# EAGLE design sawbench_analog_reva (EAGLE 6.5.0)
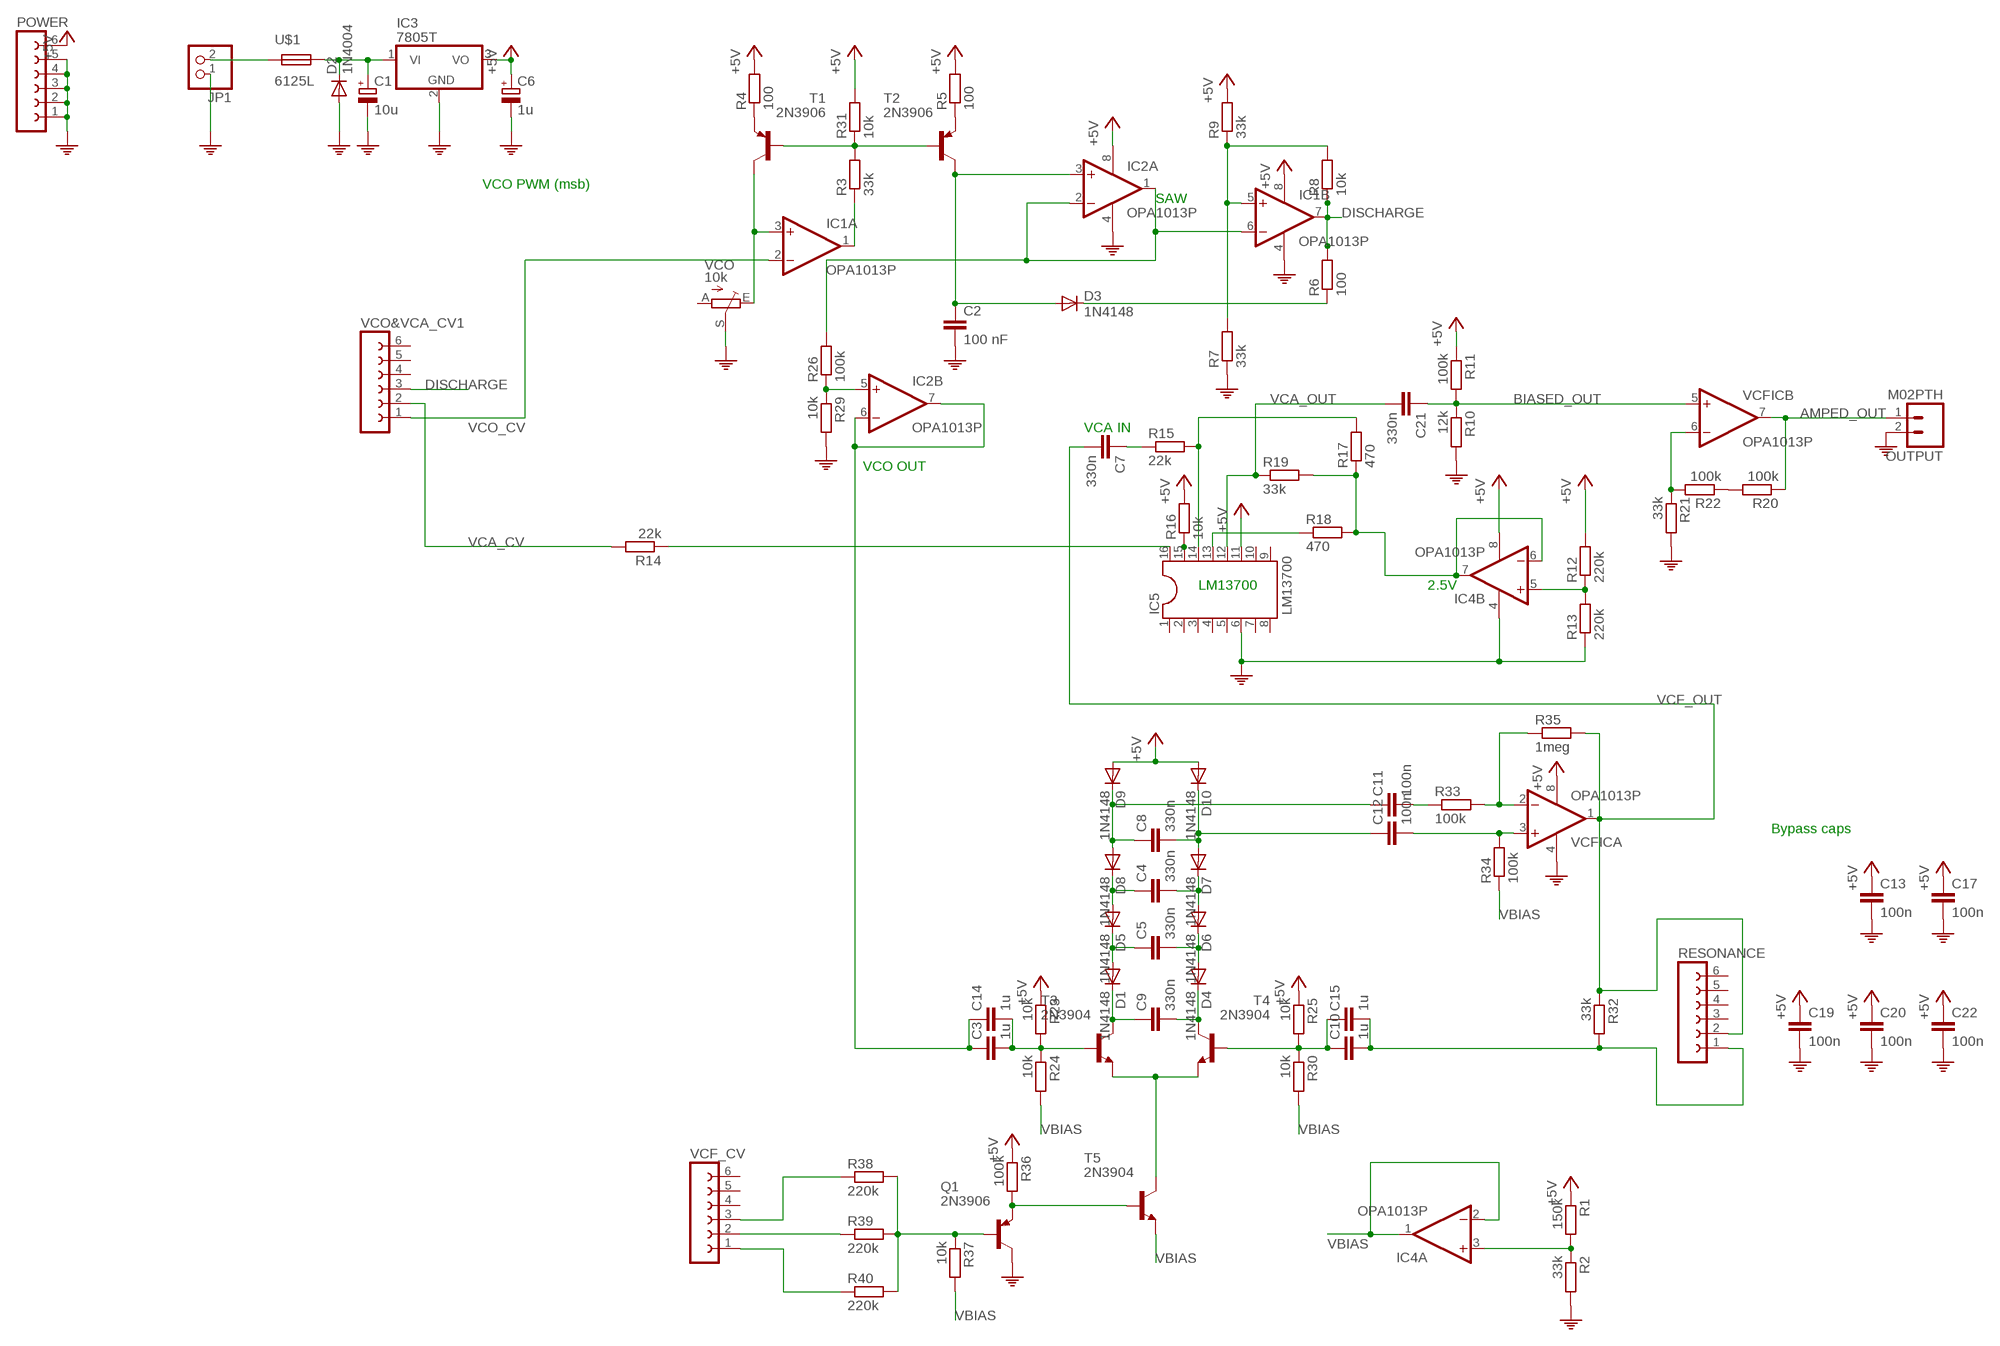
[diagram p0: schematic, sheet 1]

## Parts
C1  10u  CPOL-EUE2.5-6  [E2,5-6]
C2  100 nF  C-EU050-030X075  [C050-030X075]
C3  1u  C-EU050-024X044  [C050-024X044]
C4  330n  C-EU050-030X075  [C050-030X075]
C5  330n  C-EU050-030X075  [C050-030X075]
C6  1u  CPOL-EUE2.5-6  [E2,5-6]
C7  330n  C-EU050-024X044  [C050-024X044]
C8  330n  C-EU050-030X075  [C050-030X075]
C9  330n  C-EU050-030X075  [C050-030X075]
C10  1u  C-EU050-024X044  [C050-024X044]
C11  100n  C-EU050-025X075  [C050-025X075]
C12  100n  C-EU050-025X075  [C050-025X075]
C13  100n  C-EU025-024X044  [C025-024X044]
C14  1u  C-EU050-024X044  [C050-024X044]
C15  1u  C-EU050-024X044  [C050-024X044]
C17  100n  C-EU025-024X044  [C025-024X044]
C19  100n  C-EU025-024X044  [C025-024X044]
C20  100n  C-EU025-024X044  [C025-024X044]
C21  330n  C-EU050-024X044  [C050-024X044]
C22  100n  C-EU025-024X044  [C025-024X044]
D1  1N4148  DIODE-D-5  [D-5]
D2  1N4004  [DO41-10]
D3  1N4148  DIODE-D-5  [D-5]
D4  1N4148  DIODE-D-5  [D-5]
D5  1N4148  DIODE-D-5  [D-5]
D6  1N4148  DIODE-D-5  [D-5]
D7  1N4148  DIODE-D-5  [D-5]
D8  1N4148  DIODE-D-5  [D-5]
D9  1N4148  DIODE-D-5  [D-5]
D10  1N4148  DIODE-D-5  [D-5]
IC1  OPA1013P  [DIL08]
IC2  OPA1013P  [DIL08]
IC3  7805T  [TO220H]
IC4  OPA1013P  [DIL08]
IC5  LM13700  DIL16  [DIL16]
JP1  PINHD-1X2  [1X02]
OUTPUT  M02PTH  [1X02]
POWER  FE06-1  [FE06]
Q1  2N3906  2N3906-PNP-TO92-EBC  [TO92-EBC]
R1  150k  R-EU_0204/7  [0204/7]
R2  33k  R-EU_0204/7  [0204/7]
R3  33k  R-EU_0204/7  [0204/7]
R4  100  R-EU_0204/7  [0204/7]
R5  100  R-EU_0204/7  [0204/7]
R6  100  R-EU_0204/7  [0204/7]
R7  33k  R-EU_0204/7  [0204/7]
R8  10k  R-EU_0204/7  [0204/7]
R9  33k  R-EU_0204/7  [0204/7]
R10  12k  R-EU_0204/7  [0204/7]
R11  100k  R-EU_0204/7  [0204/7]
R12  220k  R-EU_0204/7  [0204/7]
R13  220k  R-EU_0204/7  [0204/7]
R14  22k  R-EU_0204/7  [0204/7]
R15  22k  R-EU_0204/7  [0204/7]
R16  10k  R-EU_0204/7  [0204/7]
R17  470  R-EU_0204/7  [0204/7]
R18  470  R-EU_0204/7  [0204/7]
R19  33k  R-EU_0204/7  [0204/7]
R20  100k  R-EU_0204/7  [0204/7]
R21  33k  R-EU_0204/7  [0204/7]
R22  100k  R-EU_0204/7  [0204/7]
R23  10k  R-EU_0204/7  [0204/7]
R24  10k  R-EU_0204/7  [0204/7]
R25  10k  R-EU_0204/7  [0204/7]
R26  100k  R-EU_0204/7  [0204/7]
R29  10k  R-EU_0204/7  [0204/7]
R30  10k  R-EU_0204/7  [0204/7]
R31  10k  R-EU_0204/7  [0204/7]
R32  33k  R-EU_0204/7  [0204/7]
R33  100k  R-EU_0204/7  [0204/7]
R34  100k  R-EU_0204/7  [0204/7]
R35  1meg  R-EU_0204/7  [0204/7]
R36  100k  R-EU_0204/7  [0204/7]
R37  10k  R-EU_0204/7  [0204/7]
R38  220k  R-EU_0204/7  [0204/7]
R39  220k  R-EU_0204/7  [0204/7]
R40  220k  R-EU_0204/7  [0204/7]
RESONANCE  FE06-1  [FE06]
T1  2N3906  2N3906-PNP-TO92-EBC  [TO92-EBC]
T2  2N3906  2N3906-PNP-TO92-EBC  [TO92-EBC]
T3  2N3904  2N3904-NPN-TO92-EBC  [TO92-EBC]
T4  2N3904  2N3904-NPN-TO92-EBC  [TO92-EBC]
T5  2N3904  2N3904-NPN-TO92-EBC  [TO92-EBC]
U$1  6125L  [6125L]
VCF_CV  FE06-1  [FE06]
VCFIC  OPA1013P  [DIL08]
VCO  10k  TRIM_EU-RJ9W  [RJ9W]
VCO&VCA_CV1  FE06-1  [FE06]

## Nets
+5V: C6.+ C13.1 C17.1 C19.1 C20.1 C22.1 D9.A D10.A IC1.8(P:V+) IC2.8(P:V+) IC3.3(VO) IC4.8(P:V+) IC5.11 POWER.6 R1.1 R4.2 R5.2 R9.2 R11.1 R12.2 R16.2 R23.1 R25.1 R31.2 R36.1 VCFIC.8(P:V+)
AMPED_OUT: OUTPUT.1 R20.1 VCFIC.7(B:OUT)
BIASED_OUT: C21.1 R10.1 R11.2 VCFIC.5(B:+IN)
DISCHARGE: IC1.7(B:OUT) R6.2 R8.1 VCO&VCA_CV1.3
N$1: R20.2 R22.1
N$2: IC1.3(A:+IN) T1.C VCO.E
N$3: C3.1 C14.1 IC2.6(B:-IN) IC2.7(B:OUT)
N$4: C2.1 D3.A IC2.3(A:+IN) T2.C
N$5: IC1.1(A:OUT) R3.1
N$6: R3.2 R31.1 T1.B T2.B
N$7: R4.1 T1.E
N$8: R5.1 T2.E
N$9: IC5.16 R14.1
N$10: IC1.6(B:-IN) IC2.1(A:OUT) IC2.2(A:-IN) R26.2
N$11: R40.1 VCF_CV.1
N$12: R39.1 VCF_CV.2
N$13: IC1.5(B:+IN) R7.2 R8.2 R9.1
N$14: JP1.2 U$1.P$1
N$15: D3.C R6.1
N$16: R38.1 VCF_CV.3
N$18: IC4.3(A:+IN) R1.2 R2.1
N$19: IC4.5(B:+IN) R12.1 R13.2
N$20: IC5.13 R18.1
N$21: IC5.14 R15.2 R17.2
N$22: IC5.15 R16.1
N$24: R21.1 R22.2 VCFIC.6(B:-IN)
N$26: IC4.6(B:-IN) IC4.7(B:OUT) R17.1 R18.2 R19.2
N$27: C3.2 C14.2 R23.2 R24.1 T3.B
N$28: T3.E T4.E T5.C
N$29: C9.1 D1.C T3.C
N$31: C9.2 D4.C T4.C
N$33: C5.1 D1.A D5.C
N$35: C1.+ D2.C IC3.1(VI) U$1.P$2
N$37: IC2.5(B:+IN) R26.1 R29.1
N$38: C7.1 R15.1
N$39: C4.1 D5.A D8.C
N$40: C8.1 C11.1 D8.A D9.C
N$41: C8.2 C12.1 D7.A D10.C
N$42: C4.2 D6.A D7.C
N$43: C5.2 D4.A D6.C
N$45: C10.1 C15.1 R25.2 R30.1 T4.B
N$46: C10.2 C15.2 R32.2 RESONANCE.1
N$48: C11.2 R33.1
N$49: C12.2 R34.2 VCFIC.3(A:+IN)
N$50: R33.2 R35.1 VCFIC.2(A:-IN)
N$51: Q1.E R36.2 T5.B
N$52: Q1.B R37.1 R38.2 R39.2 R40.2
PE: C1.- C2.2 C6.- C13.2 C17.2 C19.2 C20.2 C22.2 D2.A IC1.4(P:V-) IC2.4(P:V-) IC3.2(GND) IC4.4(P:V-) IC5.6 JP1.1 OUTPUT.2 POWER.1 POWER.2 POWER.3 POWER.4 POWER.5 Q1.C R2.2 R7.1 R10.2 R13.1 R21.2 R29.2 VCFIC.4(P:V-) VCO.S
VBIAS: IC4.1(A:OUT) IC4.2(A:-IN) R24.2 R30.2 R34.1 R37.2 T5.E
VCA_CV: R14.2 VCO&VCA_CV1.2
VCA_OUT: C21.2 IC5.12 R19.1
VCF_OUT: C7.2 R32.1 R35.2 RESONANCE.2 VCFIC.1(A:OUT)
VCO_CV: IC1.2(A:-IN) VCO&VCA_CV1.1
Unconnected: IC5.1 IC5.2 IC5.3 IC5.4 IC5.5 IC5.7 IC5.8 IC5.9 IC5.10 RESONANCE.3 RESONANCE.4 RESONANCE.5 RESONANCE.6 VCF_CV.4 VCF_CV.5 VCF_CV.6 VCO&VCA_CV1.4 VCO&VCA_CV1.5 VCO&VCA_CV1.6 VCO.A

## Notes on the sheet
- VCO PWM (msb)
- SAW
- VCA IN
- VCO OUT
- LM13700 | 2.5V
- Bypass caps

## Library data of the parts
C1 C6 = resistor:CPOL-EU: POLARIZED CAPACITOR, European symbol
C2 = resistor:C-EU: CAPACITOR, European symbol; CAPACITANCE: 100 nF
C3 C7 C10-C15 C17 C19-C22 = resistor:C-EU: CAPACITOR, European symbol
C4 C5 C8 C9 = rcl:C-EU: CAPACITOR, European symbol
D1 D3-D10 = diode:DIODE-: DIODE
D2 = diode:1N4004: DIODE general purpose rectifier, 1 A
IC1 IC2 IC4 VCFIC = linear:OPA1013: OP AMP
IC3 = linear:78*: Positive VOLTAGE REGULATOR Source: http://cache.national.com/ds/LM/LM78L05.pdf http://www.fairchildsemi.com/ds/LM/LM7805.pdf
IC5 = ic-package:DIL16: Dual In Line / Socket
JP1 = pinhead:PINHD-1X2: PIN HEADER
OUTPUT = SparkFun-Connectors:M02: Standard 2-pin 0.1" header. Use with - straight break away headers ( PRT-00116) - right angle break away headers (PRT-00553) - swiss pins (PRT-00743) - machine pins (PRT-00117) - female headers (PRT-00115) Molex polarized connector foot print use with: PRT-08233 with associated crimp pins and housings. 2.54_SCREWTERM for use with PRT-10571. 3.5mm Screw Terminal footprints for PRT-08084 5mm Screw Terminal footprints for use with PRT-08432
POWER RESONANCE VCF_CV VCO&VCA_CV1 = con-lsta:FE06-1: FEMALE HEADER; OC_FARNELL: unknown; OC_NEWARK: unknown
Q1 T1 T2 = transistor-neu-to92:*-PNP-: PNP Transistror
R1-R3 R6-R26 R29-R40 = resistor:R-EU_: RESISTOR, European symbol
R4 = resistor:R-EU_: RESISTOR, European symbol; R: 100 ohm
R5 = resistor:R-EU_: RESISTOR, European symbol; RESISTANCE: 100 ohm
T3-T5 = transistor-neu-to92:*-NPN-: NPN Transistror
U$1 = littlefuse:6125L
VCO = pot:TRIM_EU-: POTENTIOMETER

## Net classes
0 default: width 0.203 mm

## Board
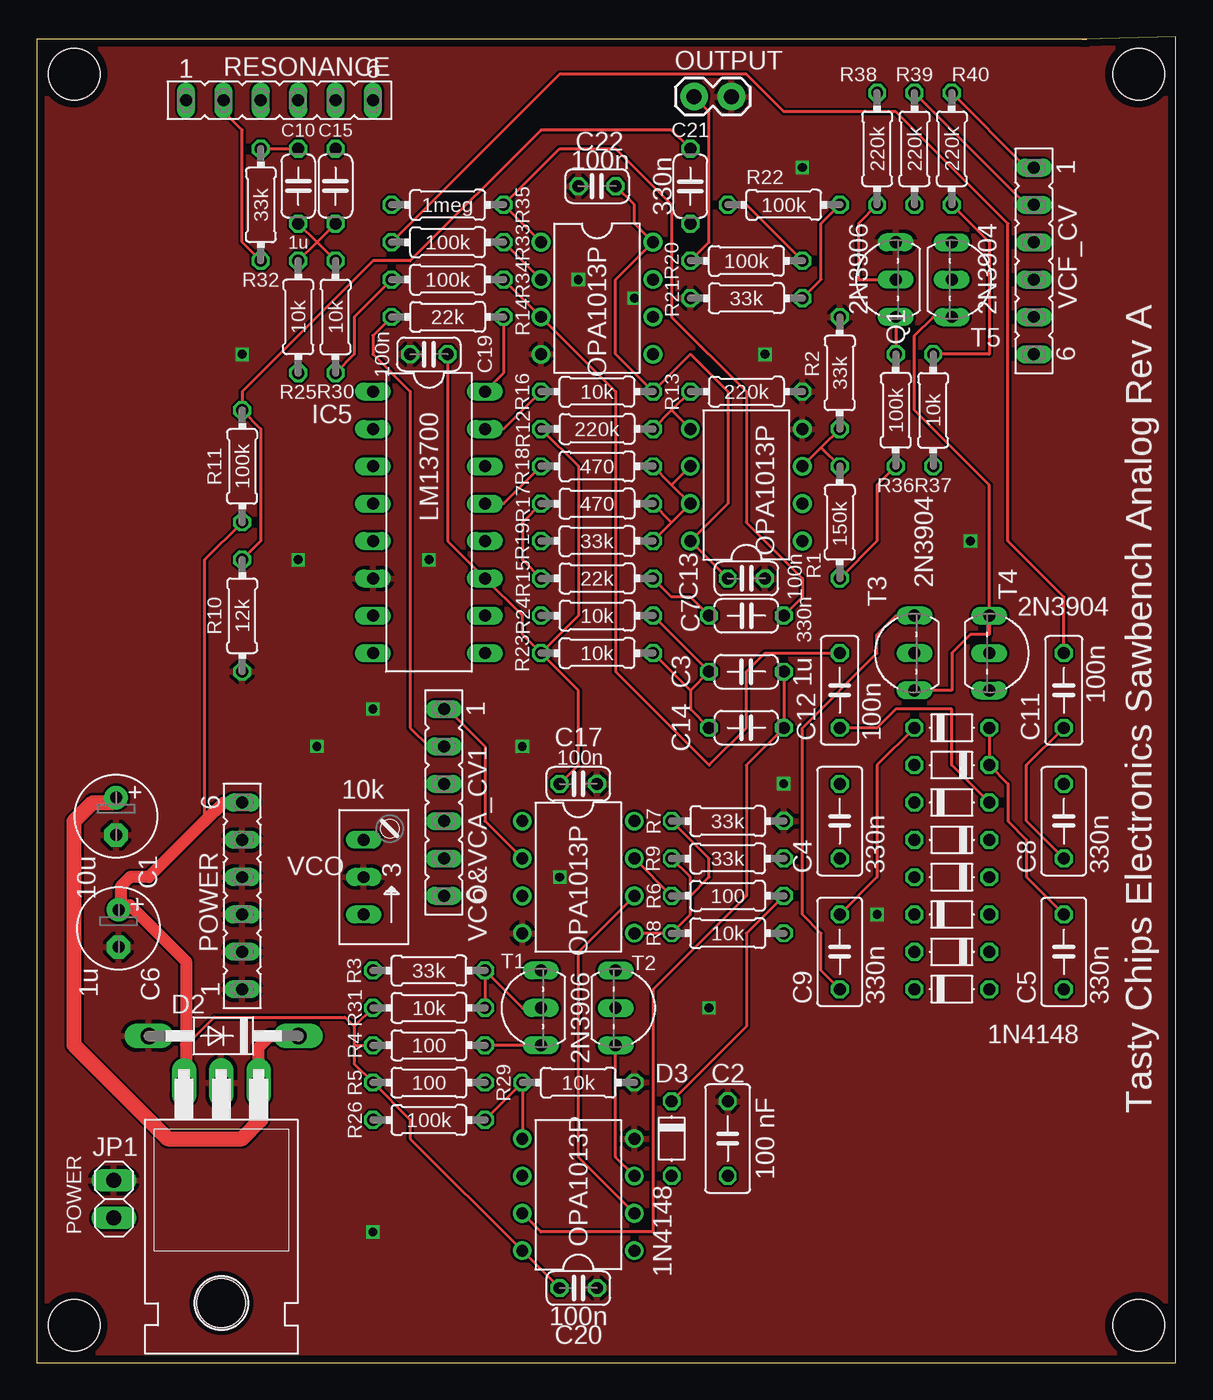
[diagram p1: board, top side]
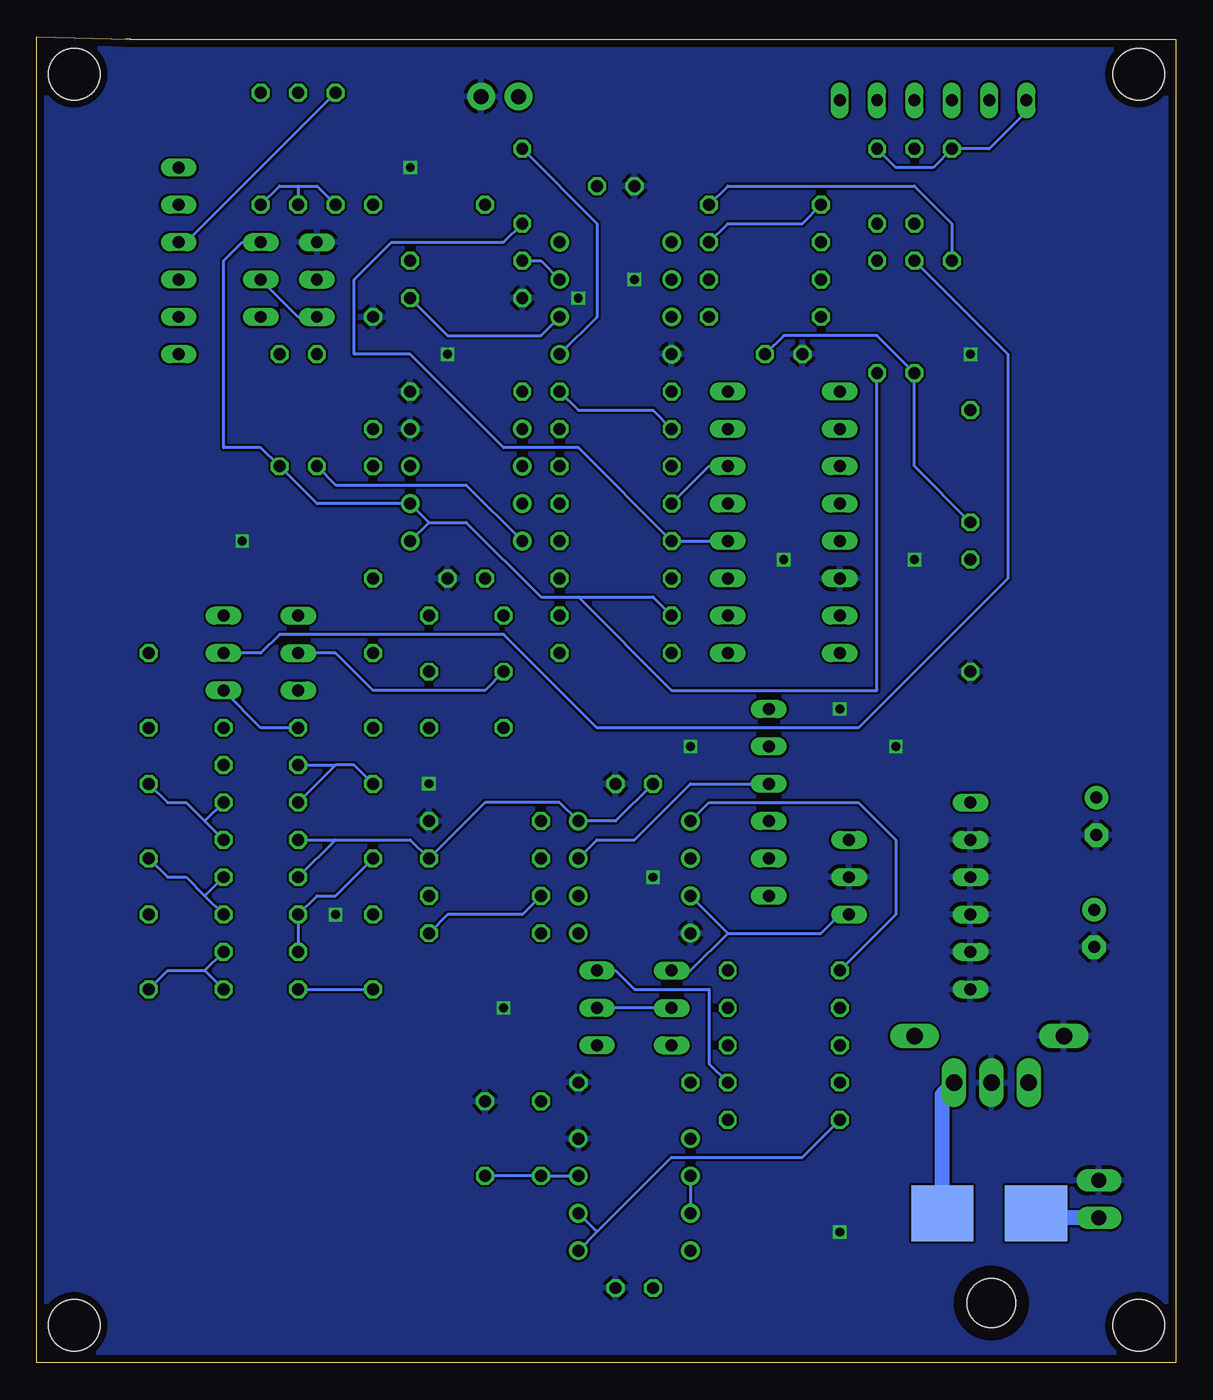
[diagram p2: board, bottom side, seen from below]

Size 77.47 x 90.17 mm. Coordinates in mm from the lower left corner, seen from the top.
Outline: 71.12,90 77.47,90.17 77.47,0 0,0 0,90 71.12,90
Outline: 71.12,90 71.42,90
Copper layers (1*16): Top 0.035mm / dielectric 1.6mm / Bottom 0.035mm
Design rules "Elecrow_2-layer_PCB_eagle_rule": minimum track width 6mil, minimum drill 12mil, track to track 6mil, track to pad 8mil, pad to pad 12mil, via to via 12mil, smd to smd 0mil, copper to edge 20mil, drill to drill 10mil, minimum pad ring 6mil, minimum via ring 6mil, stop-mask expansion 0mil, vias tented up to drill 100mil, thermal gap 10mil
Holes 3.5 mm at 2.54,87.63 2.54,2.54 74.93,2.54 74.93,87.63

### Footprints (pad centres in the part's own frame; a part is rotated, then mirrored left to right if it is on the bottom)
E2,5-6 = drill 0.813 pad 1.6: + -1.27,0 | drill 0.813 pad 1.6 octagon: - 1.27,0
C050-030X075 = drill 0.813 octagon: 1 -2.54,0; 2 2.54,0
C050-024X044 = drill 0.813 octagon: 1 -2.54,0; 2 2.54,0
C050-025X075 = drill 0.813 octagon: 1 -2.54,0; 2 2.54,0
C025-024X044 = drill 0.813 octagon: 1 -1.27,0; 2 1.27,0
D-5 = drill 0.813 octagon: A 2.54,0; C -2.54,0
DO41-10 = drill 1.118 long: A 5.08,0; C -5.08,0
DIL08 = drill 0.813 pad 1.27: 1 -3.81,-3.81; 2 -1.27,-3.81; 3 1.27,-3.81; 4 3.81,-3.81; 5 3.81,3.81; 6 1.27,3.81; 7 -1.27,3.81; 8 -3.81,3.81
TO220H = drill 1.118 long: 1 -2.54,-10.16; 2 0,-10.16; 3 2.54,-10.16 | hole 3.302: 0,4.826
DIL16 = drill 0.813 long: 1 -8.89,-3.81; 2 -6.35,-3.81; 3 -3.81,-3.81; 4 -1.27,-3.81; 5 1.27,-3.81; 6 3.81,-3.81; 7 6.35,-3.81; 8 8.89,-3.81; 9 8.89,3.81; 10 6.35,3.81; 11 3.81,3.81; 12 1.27,3.81; 13 -1.27,3.81; 14 -3.81,3.81; 15 -6.35,3.81; 16 -8.89,3.81
1X02 = drill 1.016 long: 1 -1.27,0; 2 1.27,0
1X02' = drill 1.016 pad 1.88: 1 0,0; 2 2.54,0
FE06 = drill 0.813 long: 1 -6.35,0; 2 -3.81,0; 3 -1.27,0; 4 1.27,0; 5 3.81,0; 6 6.35,0
TO92-EBC = drill 0.813 long: B 0,-1.27; C 2.54,-1.27; E -2.54,-1.27
0204/7 = drill 0.813 octagon: 1 -3.81,0; 2 3.81,0
6125L = smd 4.24 x 3.81: P$1 3.185,0; P$2 -3.185,0
RJ9W = drill 0.813 long: A 2.54,0.635; E -2.54,0.635; S 0,0.635

### Placement (x,y rotation side)
C1  5.4,37.16 270 top
C2  46.99,15.24 90 top
C3  48.26,46.99 180 top
C4  54.61,36.83 90 top
C5  69.85,27.94 90 top
C6  5.56,29.54 270 top
C7  48.26,50.8 0 top
C8  69.85,36.83 90 top
C9  54.61,27.94 90 top
C10  17.78,80.01 90 top
C11  69.85,45.72 90 top
C12  54.61,45.72 90 top
C13  48.26,53.34 0 top
C14  48.26,43.18 180 top
C15  20.32,80.01 90 top
C17  36.83,39.37 0 top
C19  26.67,68.58 180 top
C20  36.83,5.08 0 top
C21  44.45,80.01 270 top
C22  38.1,80.01 180 top
D1  62.23,25.4 0 top
D2  12.7,22.23 180 top
D3  43.18,15.24 270 top
D4  62.23,43.18 0 top
D5  62.23,27.94 180 top
D6  62.23,40.64 180 top
D7  62.23,38.1 0 top
D8  62.23,30.48 0 top
D9  62.23,33.02 180 top
D10  62.23,35.56 180 top
IC1  36.83,33.02 270 top
IC2  36.83,11.43 90 top
IC3  12.55,8.88 180 top
IC4  48.26,59.69 90 top
IC5  26.67,57.15 270 top
JP1  5.24,11.12 270 top
OUTPUT  M02PTH  [1X02']  44.7,86.11 0 top
POWER  13.97,31.75 90 top
Q1  57.15,73.66 90 top
R1  54.61,57.15 90 top
R2  54.61,67.31 90 top
R3  26.67,26.67 0 top
R4  26.67,21.59 180 top
R5  26.67,19.05 180 top
R6  46.99,31.75 180 top
R7  46.99,36.83 180 top
R8  46.99,29.21 180 top
R9  46.99,34.29 0 top
R10  13.97,50.8 270 top
R11  13.97,60.96 90 top
R12  38.1,63.5 180 top
R13  48.26,66.04 180 top
R14  27.94,71.12 180 top
R15  38.1,53.34 180 top
R16  38.1,66.04 0 top
R17  38.1,58.42 180 top
R18  38.1,60.96 0 top
R19  38.1,55.88 0 top
R20  48.26,74.93 0 top
R21  48.26,72.39 180 top
R22  50.8,78.74 0 top
R23  38.1,48.26 0 top
R24  38.1,50.8 180 top
R25  17.78,71.12 90 top
R26  26.67,16.51 180 top
R29  36.83,19.05 0 top
R30  20.32,71.12 270 top
R31  26.67,24.13 180 top
R32  15.24,78.74 90 top
R33  27.94,76.2 0 top
R34  27.94,73.66 0 top
R35  27.94,78.74 0 top
R36  58.42,64.77 90 top
R37  60.96,64.77 270 top
R38  57.15,82.55 270 top
R39  59.69,82.55 270 top
R40  62.23,82.55 270 top
RESONANCE  16.51,85.85 0 top
T1  33.02,24.13 90 top
T2  40.64,24.13 270 top
T3  58.42,48.26 90 top
T4  66.04,48.26 270 top
T5  63.5,73.66 270 top
U$1  12.7,10.16 0 bottom
VCF_CV  67.82,74.93 270 top
VCFIC  38.1,72.39 270 top
VCO  22.86,33.02 90 top
VCO&VCA_CV1  27.69,38.1 270 top

### Tracks (layer width: path | path; a pad name or v marks a point on that pad's centre or on a via)
+5V
  Top 0.203: R23.1 36.83,45.72 36.83,40.64 C17.1 | R23.1 33.02,49.53 33.02,50.8 IC5.11 27.94,55.88 C19.1 | C13.1 IC4.8 46.99,58.42 46.99,66.04 44.45,68.58 R16.2 39.37,68.58 39.37,73.66 VCFIC.8 40.64,77.47 40.64,78.74 C22.1 | R1.1 57.15,55.88 57.15,59.69 R36.1 | R23.1 36.83,50.8 36.83,60.96 R12.2 | C20.1 IC2.8 25.4,15.24 25.4,16.51 R5.2 21.59,20.32 21.59,21.59 | 21.59,22.86 21.59,21.59 | R31.2 21.59,22.86 | 21.59,21.59 R4.2 | R11.1 11.43,54.61 11.43,36.83 | 10.16,21.59 12.06,23.5 20.95,23.5 21.59,22.86
  Top 0.813: POWER.6 12.7,38.1 11.43,36.83 7.62,33.02 6.35,33.02 5.71,32.38 5.71,30.65 | 10.16,19.05 IC3.3 10.16,19.2 10.16,21.59 10.16,27.3 6.35,31.11 5.87,31.11 C6.+ 5.71,30.65 | 5.71,30.48 5.71,30.65
  Bottom 0.203: D10.A 57.15,35.56 | 57.15,35.56 52.07,35.56 R9.2 46.99,38.1 41.91,38.1 IC1.8 38.1,36.83 C17.1 | 57.15,35.56 D9.A | IC4.8 48.26,59.69 57.15,59.69 R36.1 | R12.2 35.56,64.77 40.64,64.77 R16.2 | R11.1 17.78,60.96 R25.1 20.32,69.85 26.67,69.85 C19.1
AMPED_OUT
  Top 0.203: R20.1 45.72,76.2 45.72,85.09 OUTPUT.1 44.45,86.36
  Bottom 0.203: VCFIC.7 43.18,74.93 R20.1
BIASED_OUT
  Top 0.203: R10.1 15.24,55.88 15.24,63.5 R11.2 13.97,66.04 22.86,74.93 25.4,74.93 34.29,83.82 43.18,83.82 C21.1
  Bottom 0.203: VCFIC.5 39.37,71.12 39.37,77.47 C21.1
DISCHARGE
  Top 0.203: IC1.7 R6.2
  Bottom 0.203: VCO&VCA_CV1.3 33.02,39.37 36.83,35.56 39.37,35.56 IC1.7 | R8.1 49.53,30.48 44.45,30.48 R6.2
N$1
  Top 0.203: R20.2 48.26,78.74 R22.1
N$2
  Bottom 0.203: 30.48,29.21 24.13,29.21 22.86,30.48 VCO.E | IC1.3 30.48,29.21 | T1.C 33.02,26.67 30.48,29.21
N$3
  Top 0.203: C3.1 C14.1 48.26,40.64 48.26,31.75 41.91,25.4 41.91,8.89 34.29,8.89 IC2.7
  Bottom 0.203: IC2.6 IC2.7
N$4
  Top 0.203: T2.C 39.37,13.97 IC2.3
  Bottom 0.203: IC2.3 D3.A C2.1
N$5
  Bottom 0.203: R3.1 19.05,30.48 19.05,35.56 21.59,38.1 31.75,38.1 IC1.1
N$6
  Top 0.203: R31.1 R3.2 33.02,24.13 T1.B
  Bottom 0.203: T1.B T2.B
N$7
  Top 0.203: T1.E R4.1
N$8
  Bottom 0.203: R5.1 31.75,20.32 31.75,25.4 36.83,25.4 38.1,26.67 T2.E
N$9
  Top 0.203: IC5.16 31.75,67.31 R14.1
N$10
  Top 0.203: IC1.6 36.83,27.94 36.83,13.97 IC2.2
  Bottom 0.203: 39.37,8.89 IC2.1 | IC2.2 39.37,8.89 | R26.2 25.4,13.97 34.29,13.97 39.37,8.89
N$11
  Top 0.203: R40.1 67.31,81.28 VCF_CV.1
N$12
  Top 0.203: R39.1 67.31,78.74 VCF_CV.2
N$13
  Top 0.203: IC1.5 R8.2 44.45,30.48 44.45,31.75 | R9.1 44.45,33.02 44.45,31.75 | R7.2 45.72,34.29 45.72,33.02 44.45,31.75
N$14
  Bottom 1.016: JP1.2 9.2,9.85 U$1.P$1
N$15
  Top 0.203: D3.C 48.26,22.86 48.26,29.21 R6.1
N$16
  Bottom 0.203: R38.1 67.31,76.2 VCF_CV.3
N$18
  Top 0.203: R2.1 53.34,62.23 | 53.34,62.23 IC4.3 | 53.34,62.23 R1.2
N$19
  Top 0.203: R13.2 43.18,64.77 | 43.18,64.77 R12.1 | 43.18,64.77 IC4.5
N$20
  Top 0.203: IC5.13 31.75,58.42 R18.1
N$21
  Top 0.203: R15.2 33.02,54.61 33.02,57.15 R17.2
  Bottom 0.203: IC5.14 31.75,60.96 R17.2
N$22
  Top 0.203: IC5.15 31.75,63.5 R16.1
N$24
  Top 0.203: R22.2 53.34,77.47 53.34,73.66 R21.1
  Bottom 0.203: VCFIC.6 43.18,69.85 49.53,69.85 R21.1
N$26
  Top 0.203: 43.18,57.15 IC4.7 43.18,59.69 | 43.18,57.15 R19.2 | 43.18,57.15 R17.1 | 43.18,59.69 R18.2 | 43.18,59.69 IC4.6
N$27
  Top 0.203: C14.2 44.45,44.45 44.45,45.72 | 44.45,45.72 C3.2 R24.1 | 44.45,45.72 R23.2
  Bottom 0.203: T3.B 57.15,48.26 54.61,45.72 46.99,45.72 C3.2
N$28
  Top 0.203: T3.E 62.23,45.72 62.23,48.26 63.5,49.53 64.77,49.53 T4.E 64.77,59.69 59.69,64.77 59.69,69.85 60.96,71.12 T5.C
N$29
  Top 0.203: T3.C 58.42,50.8 57.15,49.53 57.15,48.26 52.07,43.18 52.07,30.48 53.34,29.21 53.34,26.67 C9.1
  Bottom 0.203: D1.C C9.1
N$31
  Top 0.203: C9.2 57.15,33.02 57.15,40.64 D4.C
  Bottom 0.203: T4.C 62.23,43.18 D4.C
N$33
  Bottom 0.203: 66.04,26.67 D1.A | 66.04,26.67 68.58,26.67 C5.1 | 66.04,26.67 D5.C
N$35
  Top 0.813: 15.24,17.78 IC3.1 15.09,21.44 15.87,22.23 D2.C
  Top 1.016: IC3.1 15.24,16.51 13.97,15.24 8.89,15.24 2.54,21.59 2.54,36.83 3.81,38.1 5.07,38.1 C1.+
  Bottom 1.016: U$1.P$2 15.88,18.25 IC3.1
N$37
  Top 0.203: R26.1 R29.1 IC2.5
N$38
  Top 0.203: R15.1 43.18,52.07 44.45,52.07 C7.1
N$39
  Bottom 0.203: D5.A D8.C 58.42,31.75 57.15,31.75 C4.1
N$40
  Top 0.203: C11.1 67.31,40.64 67.31,36.83 C8.1
  Bottom 0.203: 66.04,31.75 67.31,33.02 68.58,33.02 C8.1 | 66.04,31.75 D8.A | 66.04,31.75 D9.C
N$41
  Top 0.203: C12.1 57.15,43.18 58.42,44.45 62.23,44.45 62.23,40.64 D7.A
  Bottom 0.203: 66.04,36.83 67.31,38.1 68.58,38.1 C8.2 | 66.04,36.83 D10.C | D7.A 66.04,36.83
N$42
  Bottom 0.203: C4.2 55.88,40.64 57.15,40.64 | D6.A 57.15,40.64 | 57.15,40.64 D7.C
N$43
  Top 0.203: D4.A D6.C 66.04,39.37 66.04,36.83 67.31,35.56 67.31,33.02 C5.2
N$45
  Top 0.203: R30.1 19.05,76.2 | 19.05,76.2 C10.1 | 19.05,76.2 C15.1 | R25.2 19.05,76.2
  Bottom 0.203: T4.B 62.23,48.26 60.96,49.53 45.72,49.53 39.37,43.18 21.59,43.18 11.43,53.34 11.43,68.58 R25.2
N$46
  Top 0.203: R32.2 C10.2
  Bottom 0.203: RESONANCE.1 10.16,85.09 12.7,82.55 R32.2 16.51,81.28 19.05,81.28 C15.2
N$48
  Top 0.203: R33.1 35.56,87.63 48.26,87.63 50.8,85.09 58.42,85.09 66.04,77.47 66.04,55.88 69.85,52.07 C11.2
N$49
  Top 0.203: C12.2 49.53,48.26 48.26,46.99 48.26,43.18 45.72,40.64 39.37,46.99 39.37,66.04 VCFIC.3 R34.2
N$50
  Top 0.203: R33.2 VCFIC.2
  Bottom 0.203: R35.1 25.4,77.47 30.48,77.47 R33.2
N$51
  Top 0.203: Q1.E R36.2
  Bottom 0.203: T5.B 59.69,71.12 Q1.E
N$52
  Top 0.203: R37.1 64.77,68.58 64.77,76.2 R40.2 | Q1.B 55.88,73.66 55.88,77.47 R38.2
  Bottom 0.203: R38.2 58.42,80.01 59.69,80.01 | 59.69,80.01 60.96,80.01 R40.2 | 59.69,80.01 R39.2
PE  (via drill 0.6)
  other vias: 13.97,68.58 19.05,41.91 22.86,8.89 45.72,24.13 50.8,39.37 33.02,41.91 17.78,54.61 52.07,81.28 22.86,44.45 26.67,54.61 63.5,55.88 57.15,30.48 36.83,73.66 49.53,68.58 35.56,33.02 40.64,72.39
  pour Bottom: 0,90.17 0,0 77.47,0 77.47,90.17
  pour Top: 0,90.17 77.47,90.17 77.47,0 0,0
VBIAS
  Top 0.203: R30.2 21.59,68.58 21.59,71.12 R34.1
  Bottom 0.203: R24.2 35.56,52.07 40.64,52.07 | 40.64,52.07 43.18,52.07 48.26,57.15 50.8,57.15 | 50.8,57.15 IC4.2 58.42,58.42 R37.2 62.23,62.23 64.77,62.23 64.77,74.93 63.5,76.2 T5.E | 50.8,57.15 IC4.1 | R30.2 20.32,45.72 34.29,45.72 40.64,52.07
VCA_CV
  Top 0.203: R14.2 22.86,69.85 22.86,68.58 25.4,66.04 25.4,43.18 26.67,41.91 VCO&VCA_CV1.2
VCA_OUT
  Bottom 0.203: IC5.12 R19.1 40.64,62.23 45.72,62.23 52.07,68.58 55.88,68.58 55.88,73.66 53.34,76.2 45.72,76.2 C21.2
VCF_OUT
  Top 0.203: R32.1 13.97,76.2 13.97,83.82 12.7,85.09 RESONANCE.2 | C7.2 52.07,52.07 52.07,53.34 48.26,57.15 48.26,66.04 43.18,71.12 43.18,78.74 39.37,82.55 35.56,82.55 R35.2 VCFIC.1
  Bottom 0.203: R32.1 15.24,77.47 17.78,80.01 30.48,80.01 R35.2
VCO_CV
  Top 0.203: IC1.2 30.48,36.83 30.48,41.91 27.94,44.45 VCO&VCA_CV1.1

### Text on the board
tNames: Tasty Chips Electronics Sawbench Analog Rev A | POWER